# Altium schematic sheet 06-Front Panel SFP_2.SchDoc
size B; SheetNumber: 5; SheetTotal: 14
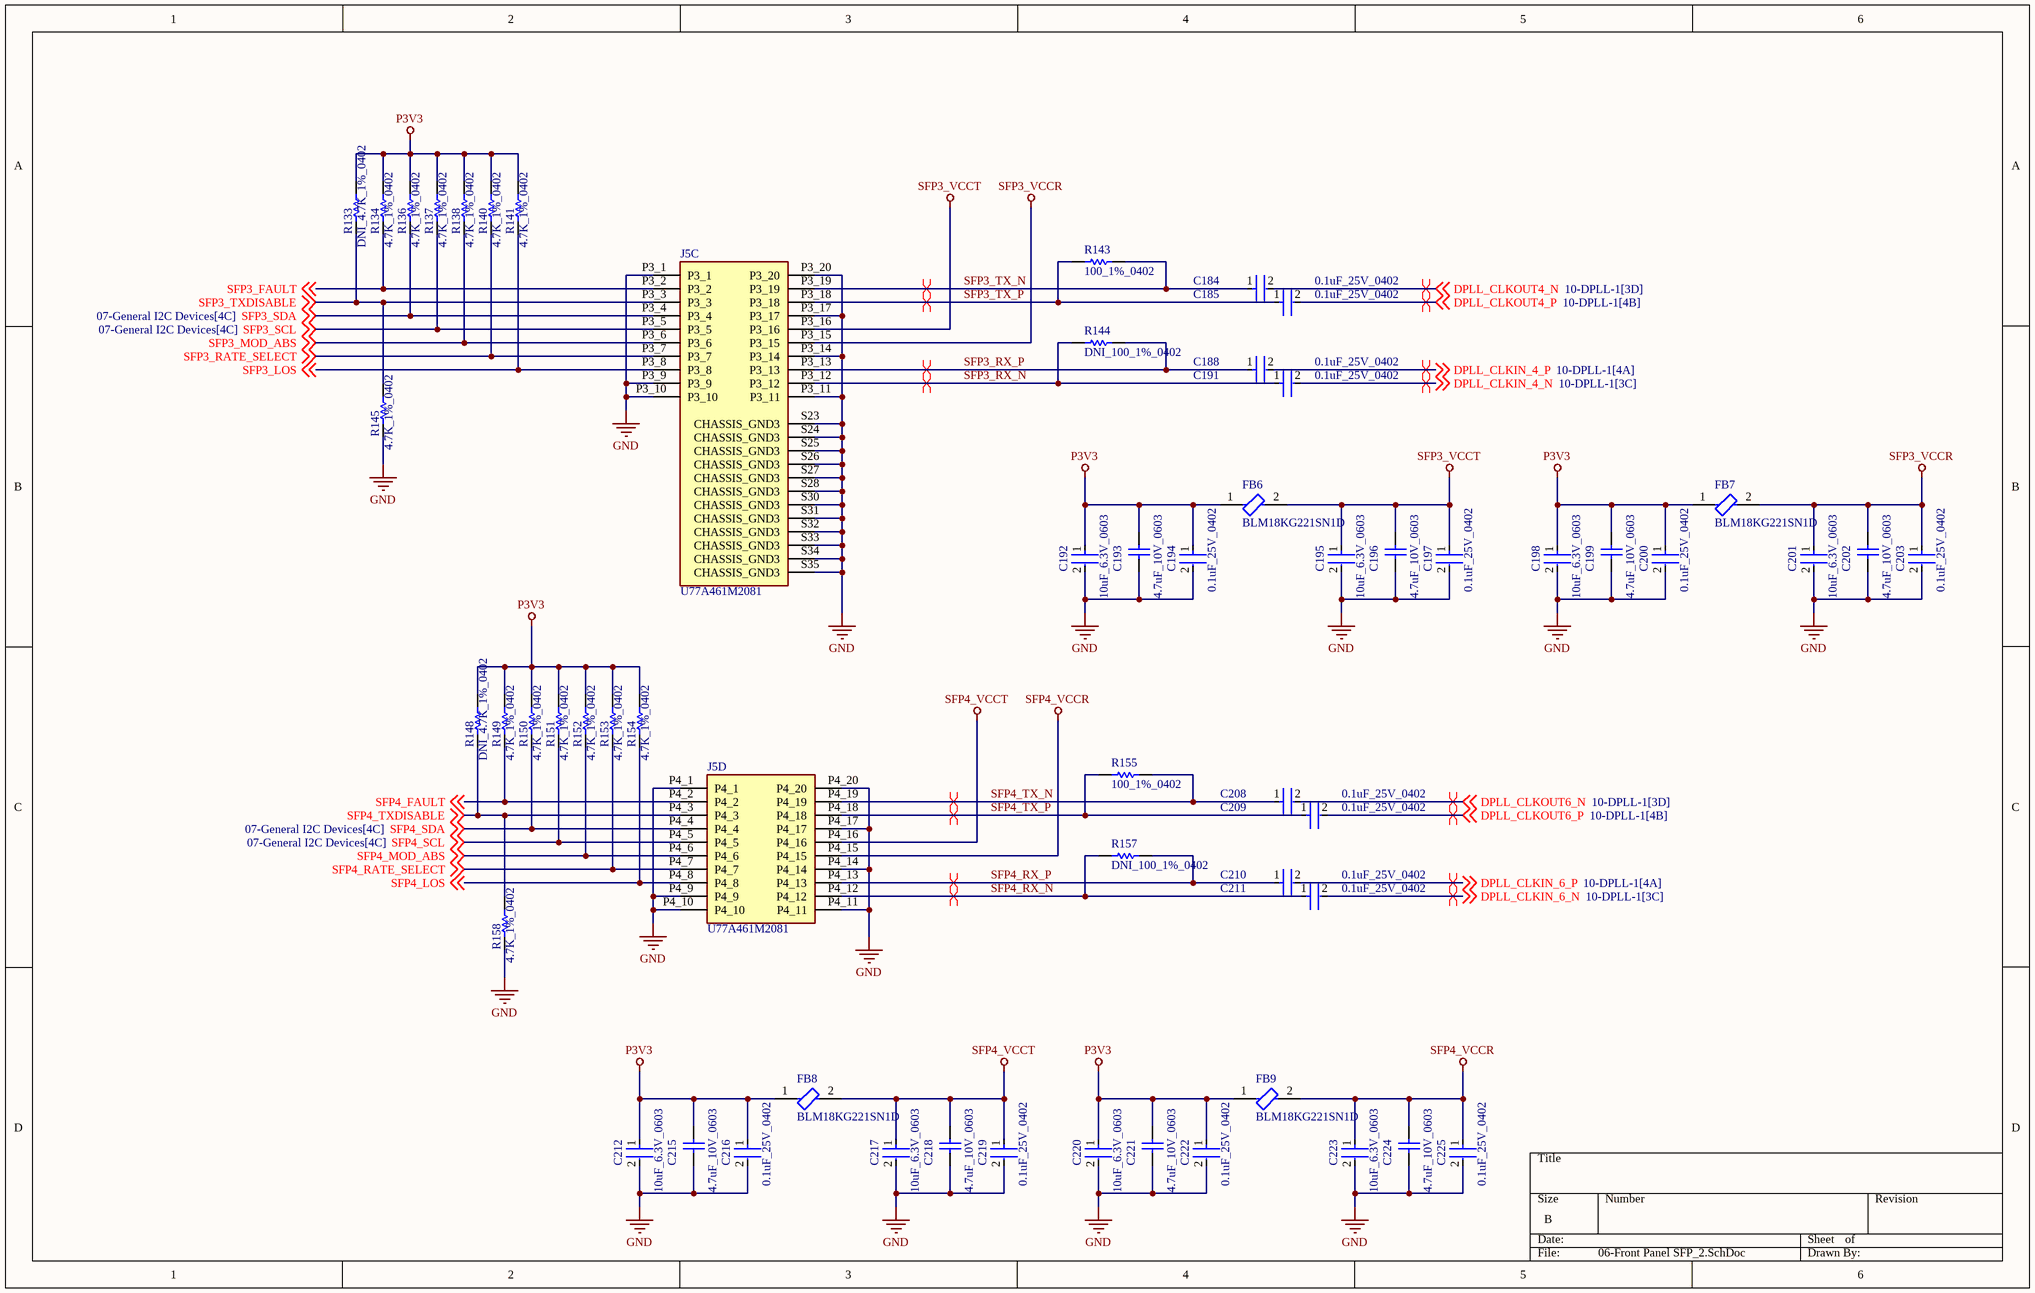
[diagram p0: 06-Front Panel SFP_2.SchDoc]

## Parts
C184  0.1uF_25V_0402  [FP-0402-L_1_0_1-W_0_5_0_1-IPC_C]
C185  0.1uF_25V_0402  [FP-0402-L_1_0_1-W_0_5_0_1-IPC_C]
C188  0.1uF_25V_0402  [FP-0402-L_1_0_1-W_0_5_0_1-IPC_C]
C191  0.1uF_25V_0402  [FP-0402-L_1_0_1-W_0_5_0_1-IPC_C]
C192  10uF_6.3V_0603  [FP-C0603C106M9PACTU-MFG]
C193  4.7uF_10V_0603  [CAPC1608X87X35NL15T15]
C194  0.1uF_25V_0402  [FP-0402-L_1_0_1-W_0_5_0_1-IPC_C]
C195  10uF_6.3V_0603  [FP-C0603C106M9PACTU-MFG]
C196  4.7uF_10V_0603  [CAPC1608X87X35NL15T15]
C197  0.1uF_25V_0402  [FP-0402-L_1_0_1-W_0_5_0_1-IPC_C]
C198  10uF_6.3V_0603  [FP-C0603C106M9PACTU-MFG]
C199  4.7uF_10V_0603  [CAPC1608X87X35NL15T15]
C200  0.1uF_25V_0402  [FP-0402-L_1_0_1-W_0_5_0_1-IPC_C]
C201  10uF_6.3V_0603  [FP-C0603C106M9PACTU-MFG]
C202  4.7uF_10V_0603  [CAPC1608X87X35NL15T15]
C203  0.1uF_25V_0402  [FP-0402-L_1_0_1-W_0_5_0_1-IPC_C]
C208  0.1uF_25V_0402  [FP-0402-L_1_0_1-W_0_5_0_1-IPC_C]
C209  0.1uF_25V_0402  [FP-0402-L_1_0_1-W_0_5_0_1-IPC_C]
C210  0.1uF_25V_0402  [FP-0402-L_1_0_1-W_0_5_0_1-IPC_C]
C211  0.1uF_25V_0402  [FP-0402-L_1_0_1-W_0_5_0_1-IPC_C]
C212  10uF_6.3V_0603  [FP-C0603C106M9PACTU-MFG]
C215  4.7uF_10V_0603  [CAPC1608X87X35NL15T15]
C216  0.1uF_25V_0402  [FP-0402-L_1_0_1-W_0_5_0_1-IPC_C]
C217  10uF_6.3V_0603  [FP-C0603C106M9PACTU-MFG]
C218  4.7uF_10V_0603  [CAPC1608X87X35NL15T15]
C219  0.1uF_25V_0402  [FP-0402-L_1_0_1-W_0_5_0_1-IPC_C]
C220  10uF_6.3V_0603  [FP-C0603C106M9PACTU-MFG]
C221  4.7uF_10V_0603  [CAPC1608X87X35NL15T15]
C222  0.1uF_25V_0402  [FP-0402-L_1_0_1-W_0_5_0_1-IPC_C]
C223  10uF_6.3V_0603  [FP-C0603C106M9PACTU-MFG]
C224  4.7uF_10V_0603  [CAPC1608X87X35NL15T15]
C225  0.1uF_25V_0402  [FP-0402-L_1_0_1-W_0_5_0_1-IPC_C]
FB6  BLM18KG221SN1D  [FP-BLM18-0_15-t0_8-IPC_B]
FB7  BLM18KG221SN1D  [FP-BLM18-0_15-t0_8-IPC_B]
FB8  BLM18KG221SN1D  [FP-BLM18-0_15-t0_8-IPC_B]
FB9  BLM18KG221SN1D  [FP-BLM18-0_15-t0_8-IPC_B]
J5  U77A461M2081  [AMPHENOL_U77A461M2081]  (parts C,D of 4)
R133  DNI_4.7K_1%_0402  [RESC1005X40X25NL10T10]  (no BOM)
R134  4.7K_1%_0402  [RESC1005X40X25NL10T10]
R136  4.7K_1%_0402  [RESC1005X40X25NL10T10]
R137  4.7K_1%_0402  [RESC1005X40X25NL10T10]
R138  4.7K_1%_0402  [RESC1005X40X25NL10T10]
R140  4.7K_1%_0402  [RESC1005X40X25NL10T10]
R141  4.7K_1%_0402  [RESC1005X40X25NL10T10]
R143  100_1%_0402  [RESC1005X40X25NL05T10]
R144  DNI_100_1%_0402  [RESC1005X40X25NL05T10]  (no BOM)
R145  4.7K_1%_0402  [RESC1005X40X25NL10T10]
R148  DNI_4.7K_1%_0402  [RESC1005X40X25NL10T10]  (no BOM)
R149  4.7K_1%_0402  [RESC1005X40X25NL10T10]
R150  4.7K_1%_0402  [RESC1005X40X25NL10T10]
R151  4.7K_1%_0402  [RESC1005X40X25NL10T10]
R152  4.7K_1%_0402  [RESC1005X40X25NL10T10]
R153  4.7K_1%_0402  [RESC1005X40X25NL10T10]
R154  4.7K_1%_0402  [RESC1005X40X25NL10T10]
R155  100_1%_0402  [RESC1005X40X25NL05T10]
R157  DNI_100_1%_0402  [RESC1005X40X25NL05T10]  (no BOM)
R158  4.7K_1%_0402  [RESC1005X40X25NL10T10]

## Nets
GND: C192.2 C193.1 C194.2 C195.2 C196.1 C197.2 C198.2 C199.1 C200.2 C201.2 C202.1 C203.2 C212.2 C215.1 C216.2 C217.2 C218.1 C219.2 C220.2 C221.1 C222.2 C223.2 C224.1 C225.2 J5.P3_1 J5.P3_9 J5.P3_10 J5.P3_11 J5.P3_14 J5.P3_17 J5.P3_20 J5.P4_1 J5.P4_9 J5.P4_10 J5.P4_11 J5.P4_14 J5.P4_17 J5.P4_20 J5.S23(CHASSIS_GND3) J5.S24(CHASSIS_GND3) J5.S25(CHASSIS_GND3) J5.S26(CHASSIS_GND3) J5.S27(CHASSIS_GND3) J5.S28(CHASSIS_GND3) J5.S30(CHASSIS_GND3) J5.S31(CHASSIS_GND3) J5.S32(CHASSIS_GND3) J5.S33(CHASSIS_GND3) J5.S34(CHASSIS_GND3) J5.S35(CHASSIS_GND3) R145.2 R158.2
P3V3: C192.1 C193.2 C194.1 C198.1 C199.2 C200.1 C212.1 C215.2 C216.1 C220.1 C221.2 C222.1 FB6.1 FB7.1 FB8.1 FB9.1 R133.1 R134.1 R136.1 R137.1 R138.1 R140.1 R141.1 R148.1 R149.1 R150.1 R151.1 R152.1 R153.1 R154.1
SFP3_VCCR: C201.1 C202.2 C203.1 FB7.2 J5.P3_15
SFP3_VCCT: C195.1 C196.2 C197.1 FB6.2 J5.P3_16
SFP4_VCCR: C223.1 C224.2 C225.1 FB9.2 J5.P4_15
SFP4_VCCT: C217.1 C218.2 C219.1 FB8.2 J5.P4_16
DPLL_CLKIN_4_N: C191.2 ; off-sheet DPLL_CLKIN_4_N
DPLL_CLKIN_4_P: C188.2 ; off-sheet DPLL_CLKIN_4_P
DPLL_CLKIN_6_N: C211.2 ; off-sheet DPLL_CLKIN_6_N
DPLL_CLKIN_6_P: C210.2 ; off-sheet DPLL_CLKIN_6_P
DPLL_CLKOUT4_N: C184.2 ; off-sheet DPLL_CLKOUT4_N
DPLL_CLKOUT4_P: C185.2 ; off-sheet DPLL_CLKOUT4_P
DPLL_CLKOUT6_N: C208.2 ; off-sheet DPLL_CLKOUT6_N
DPLL_CLKOUT6_P: C209.2 ; off-sheet DPLL_CLKOUT6_P
SFP3_FAULT: J5.P3_2 R134.2 ; off-sheet SFP3_FAULT
SFP3_LOS: J5.P3_8 R141.2 ; off-sheet SFP3_LOS
SFP3_MOD_ABS: J5.P3_6 R138.2 ; off-sheet SFP3_MOD_ABS
SFP3_RATE_SELECT: J5.P3_7 R140.2 ; off-sheet SFP3_RATE_SELECT
SFP3_RX_N: C191.1 J5.P3_12 R144.1
SFP3_RX_P: C188.1 J5.P3_13 R144.2
SFP3_SCL: J5.P3_5 R137.2 ; off-sheet SFP3_SCL
SFP3_SDA: J5.P3_4 R136.2 ; off-sheet SFP3_SDA
SFP3_TX_N: C184.1 J5.P3_19 R143.2
SFP3_TX_P: C185.1 J5.P3_18 R143.1
SFP3_TXDISABLE: J5.P3_3 R133.2 R145.1 ; off-sheet SFP3_TXDISABLE
SFP4_FAULT: J5.P4_2 R149.2 ; off-sheet SFP4_FAULT
SFP4_LOS: J5.P4_8 R154.2 ; off-sheet SFP4_LOS
SFP4_MOD_ABS: J5.P4_6 R152.2 ; off-sheet SFP4_MOD_ABS
SFP4_RATE_SELECT: J5.P4_7 R153.2 ; off-sheet SFP4_RATE_SELECT
SFP4_RX_N: C211.1 J5.P4_12 R157.1
SFP4_RX_P: C210.1 J5.P4_13 R157.2
SFP4_SCL: J5.P4_5 R151.2 ; off-sheet SFP4_SCL
SFP4_SDA: J5.P4_4 R150.2 ; off-sheet SFP4_SDA
SFP4_TX_N: C208.1 J5.P4_19 R155.2
SFP4_TX_P: C209.1 J5.P4_18 R155.1
SFP4_TXDISABLE: J5.P4_3 R148.2 R158.1 ; off-sheet SFP4_TXDISABLE

## Layout directives
differential pair: DPLL_CLKIN_4_N, DPLL_CLKIN_4_P, DPLL_CLKIN_6_N, DPLL_CLKIN_6_P, DPLL_CLKOUT4_N, DPLL_CLKOUT4_P, DPLL_CLKOUT6_N, DPLL_CLKOUT6_P, SFP3_RX_N, SFP3_RX_P, SFP3_TX_N, SFP3_TX_P, SFP4_RX_N, SFP4_RX_P, SFP4_TX_N, SFP4_TX_P

## Library data of the parts
C184 C185 C188 C191 C194 C197 C200 C203 C208-C211 C216 C219 C222 C225 = CMP-2008-02519-2: General Purpose Ceramic Capacitor, 0402, 100nF, 10%, X7R, 15%, 25V; Package Quantity: 1; Capacitance: 100nF; Min Operating Temperature: -55°C; Voltage: 25V; Voltage Rating: 25V; Construction: Flat; Max Operating Temperature: 125°C; Radiation Hardening: No; Depth: 0.5mm; Thickness: 0.022inch; Voltage Rating (DC): 25V; Number of Pins: 2; Lead Free: Lead Free; Series: -; REACH SVHC: No SVHC; Length: 1mm; Dielectric: X7R; RoHS Compliant: Yes; Mount: Surface Mount; Packaging: Tape and Reel; Case/Package: 0402; Case Code (Imperial): 0402; Termination: SMD/SMT; Width: 0.02inch; Case Code (Metric): 1005; Tolerance: 10%
C192 C195 C198 C201 C212 C217 C220 C223 = CMP-2006-02285-3: CAP CER 10UF 6.3V X5R 0603; Manufacturer Part Number: C0603C106M9PACTU; Manufacturer: Kemet; Material: Ceramic; Temperature Coefficient: 15%; Tolerance: 20%; Category: Cap; Height: 0.9mm; Digikey Description: CAP CER 10UF 6.3V X5R 0603; Mouser Description: In a Pack of 10, KEMET 0603 (1608M) 10µF MLCC 6.3V dc ±20% SMD C0603C106M9PACTU; Voltage Rating: 6.3V; Device Class L2: Capacitors; Temperature Range Low: -55°C; Temperature Characteristic: X5R; ComponentLink2Description: Datasheet; Ipc Land Pattern Name: CAPC16080X80; ComponentLink2URL: http://www.kemet.com/Lists/ProductCatalog/Attachments/19/KEM_C1006_X5R_SMD.pdf; Capacitance: 10uF; Temperature Range High: +85°C; Device Class L3: Ceramic Capacitors; RoHS: TRUE; Automotive: No; Value: 10uF; Temperature: -55°C to +85°C; Device Class L1: Passive Components; Package: C0603C106M9PACTU; Lead Free: Yes; Octopart: https://octopart.com/c0603c106m9pactu-kemet-8375727
C193 C196 C199 C202 C215 C218 C221 C224 = CMP-2006-03238-1: Part Number: C0603C475K8PACTU; Manufacturer: Kemet
FB6-FB9 = CMP-0686-00556-7: Chip Ferrite Bead, 0603, 220Ω @ 100MHz, 0.05Ω, 25%, 2.2A; DC Resistance (DCR): 50mR; Number of Circuits: 1; Impedance: 220R; Current Rating: 2.2A; Material: Ferrite; Test Frequency: 100MHz; Depth: 0.8mm; Series: BLM18K; RoHS Compliant: Yes; Termination: SMD/SMT; Max Current Rating: 2.2A; Case Code (Metric): 1608; Radiation Hardening: No; Number of Pins: 2; Length: 1.6mm; Lead Free: Lead Free; Package Quantity: 1; Height: 0.8mm; Core Material: Ferrite; Inductor Type: FERRITE BEAD; Min Operating Temperature: -55°C; Case/Package: 0603; Case Code (Imperial): 0603; Number of Lines: 1; Packaging: Tape and Reel; REACH SVHC: No SVHC; Max Operating Temperature: 125°C; Military Standard: Not; DC Resistance-Max: 50mR; Width: 0.8mm; DC Current: 2.2A; Max DC Current: 2.2A; Tolerance: 25%; Weight: 7.1E-05oz
J5 = U77A461M2081: MF: AMPHENOL ICC / FCI; Package: None; Price: None; Value: *; MP: U77A461M2081; Availability: Unavailable
R133 R134 R136-R138 R140 R141 R145 R148-R154 R158 = CMP-2002-05217-1: Manufacturer: Bourns; Part Number: CR0402-FX-4701GLF
R143 R144 R155 R157 = CMP-2002-07853-1: Manufacturer: Yageo; Part Number: RC0402FR-13100RL